# Altium project pcb_heater.PrjPcb
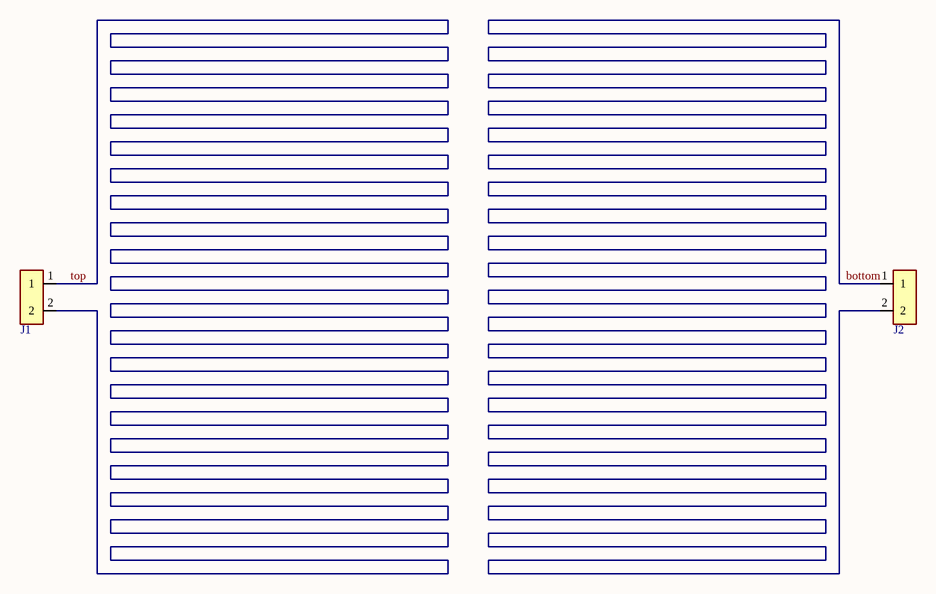
[diagram p0: pcb_heater.SchDoc]
1 sheet, 2 parts. Net scope: global (net labels, ports and power ports of the same name join across sheets).
Board file: pcb_heater.PcbDoc

## Sheet pcb_heater.SchDoc
size A4; SheetNumber: 1; SheetTotal: 1

### Parts
J1  Connector, PCB heater  [pcb_heater_connector]  (value not drawn)
J2  Connector, PCB heater  [pcb_heater_connector]  (value not drawn)

### Nets
bottom: J2.1 J2.2
top: J1.1 J1.2